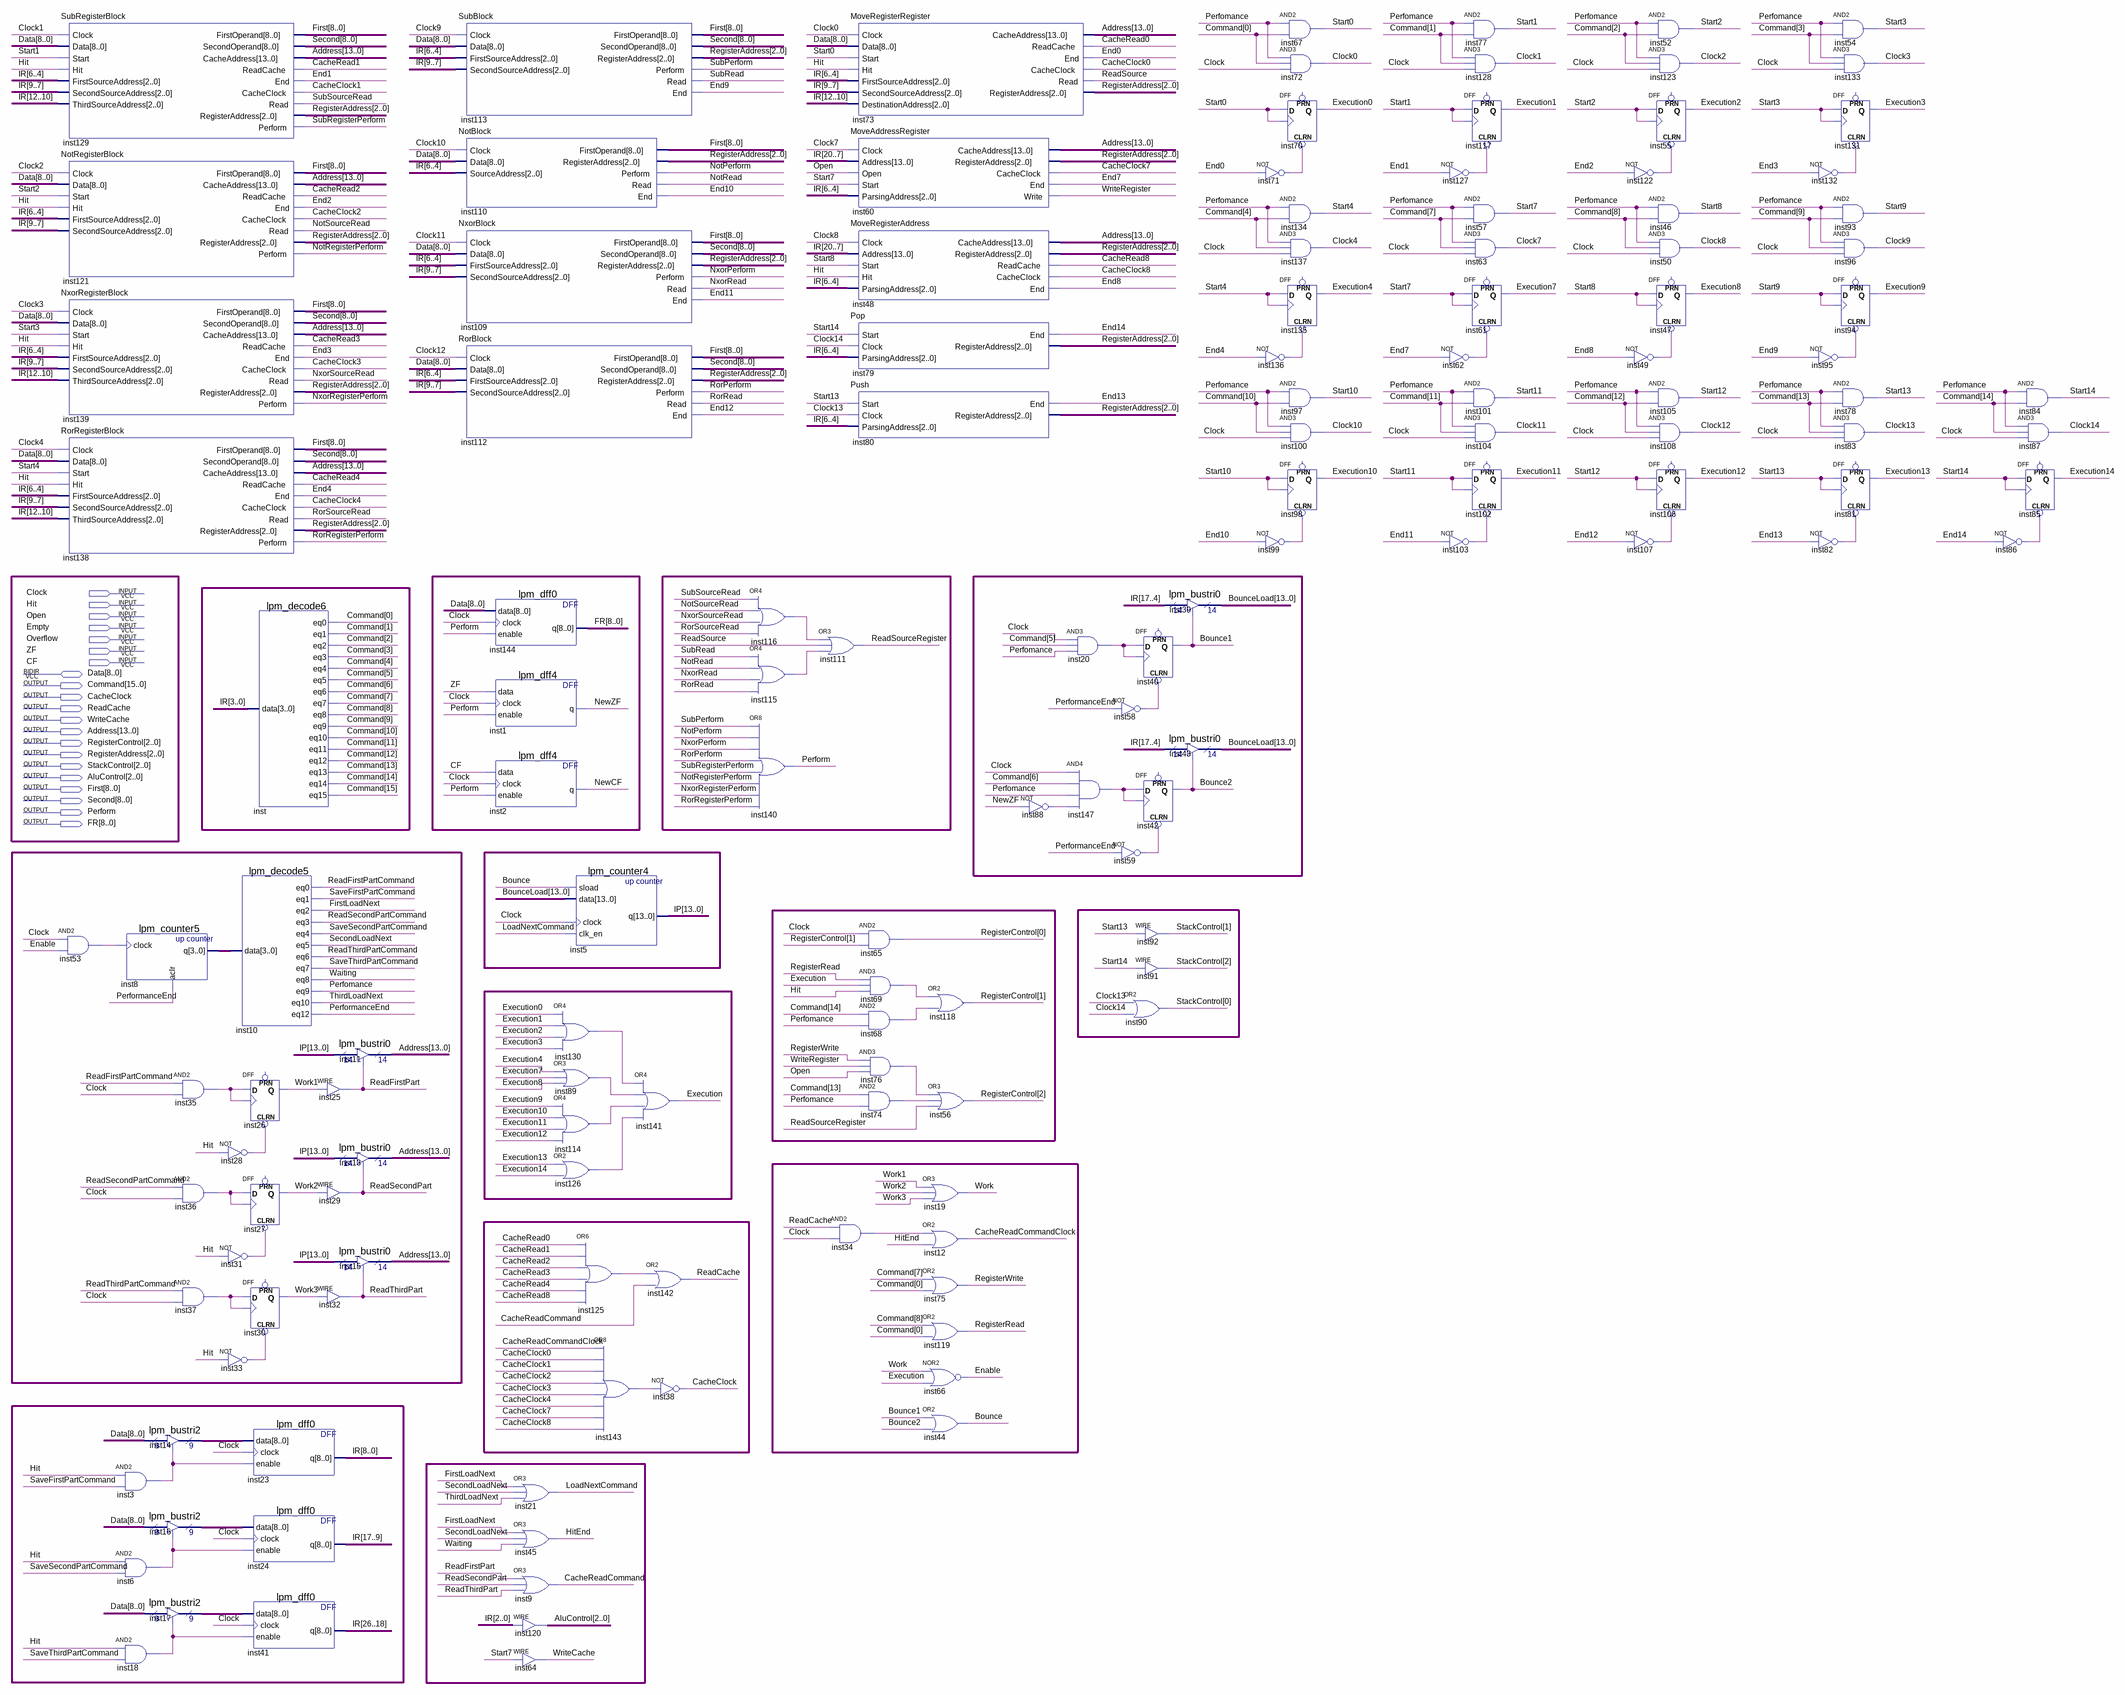
[diagram p0: schematic sheet]
// Quartus schematic ControlUnitBlock.bdf as structural Verilog: 141 symbols, 21 pins
module ControlUnitBlock (
  input  Clock,
  input  Hit,
  input  Open,
  input  Empty,
  input  Overflow,
  input  ZF,
  input  CF,
  inout  [8:0] Data,
  output [15:0] Command,
  output CacheClock,
  output ReadCache,
  output WriteCache,
  output [13:0] Address,
  output [2:0] RegisterControl,
  output [2:0] RegisterAddress,
  output [2:0] StackControl,
  output [2:0] AluControl,
  output [8:0] First,
  output [8:0] Second,
  output Perform,
  output [8:0] FR
);

  wire Bounce, Bounce1, Bounce2, CacheClock0, CacheClock1, CacheClock2, CacheClock3, CacheClock4,
       CacheClock7, CacheClock8, CacheRead0, CacheRead1, CacheRead2, CacheRead3, CacheRead4, CacheRead8,
       CacheReadCommand, CacheReadCommandClock, Clock0, Clock1, Clock2, Clock3, Clock4, Clock7, Clock8,
       Clock9, Clock10, Clock11, Clock12, Clock13, Clock14, Enable, End0, End1, End2, End3, End4, End7, End8,
       End9, End10, End11, End12, End13, End14, Execution, Execution0, Execution1, Execution2, Execution3,
       Execution4, Execution7, Execution8, Execution9, Execution10, Execution11, Execution12, Execution13,
       Execution14, FirstLoadNext, HitEnd, inst3_out, inst6_out, inst18_out, inst20_out, inst28_out,
       inst31_out, inst33_out, inst34_out, inst35_out, inst36_out, inst37_out, inst49_out, inst53_out,
       inst58_out, inst59_out, inst62_out, inst68_out, inst69_out, inst71_out, inst74_out, inst76_out,
       inst82_out, inst86_out, inst88_out, inst89_out, inst95_out, inst99_out, inst103_out, inst107_out,
       inst114_out, inst115_out, inst116_out, inst122_out, inst125_out, inst126_out, inst127_out,
       inst130_out, inst132_out, inst136_out, inst143_out, inst147_out, LoadNextCommand, NewCF, NewZF,
       NotPerform, NotRead, NotRegisterPerform, NotSourceRead, NxorPerform, NxorRead, NxorRegisterPerform,
       NxorSourceRead, Perfomance, PerformanceEnd, ReadFirstPart, ReadFirstPartCommand, ReadSecondPart,
       ReadSecondPartCommand, ReadSource, ReadSourceRegister, ReadThirdPart, ReadThirdPartCommand,
       RegisterRead, RegisterWrite, RorPerform, RorRead, RorRegisterPerform, RorSourceRead,
       SaveFirstPartCommand, SaveSecondPartCommand, SaveThirdPartCommand, SecondLoadNext, Start0, Start1,
       Start2, Start3, Start4, Start7, Start8, Start9, Start10, Start11, Start12, Start13, Start14,
       SubPerform, SubRead, SubRegisterPerform, SubSourceRead, ThirdLoadNext, Waiting, Work, Work1, Work2,
       Work3, WriteRegister;
  wire [3:0] inst8_q;
  wire [8:0] inst14_tridata, inst16_tridata, inst17_tridata;
  wire [13:0] BounceLoad, IP;
  wire [26:0] IR;

  SubRegisterBlock inst129 (
    .Clock(Clock1), .Data(Data), .Start(Start1), .Hit(Hit), .FirstSourceAddress(IR[6:4]),
    .SecondSourceAddress(IR[9:7]), .ThirdSourceAddress(IR[12:10]), .FirstOperand(First),
    .SecondOperand(Second), .CacheAddress(Address), .ReadCache(CacheRead1), .End(End1),
    .CacheClock(CacheClock1), .Read(SubSourceRead), .RegisterAddress(RegisterAddress),
    .Perform(SubRegisterPerform));
  NotRegisterBlock inst121 (
    .Clock(Clock2), .Data(Data), .Start(Start2), .Hit(Hit), .FirstSourceAddress(IR[6:4]),
    .SecondSourceAddress(IR[9:7]), .FirstOperand(First), .CacheAddress(Address), .ReadCache(CacheRead2),
    .End(End2), .CacheClock(CacheClock2), .Read(NotSourceRead), .RegisterAddress(RegisterAddress),
    .Perform(NotRegisterPerform));
  NxorRegisterBlock inst139 (
    .Clock(Clock3), .Data(Data), .Start(Start3), .Hit(Hit), .FirstSourceAddress(IR[6:4]),
    .SecondSourceAddress(IR[9:7]), .ThirdSourceAddress(IR[12:10]), .FirstOperand(First),
    .SecondOperand(Second), .CacheAddress(Address), .ReadCache(CacheRead3), .End(End3),
    .CacheClock(CacheClock3), .Read(NxorSourceRead), .RegisterAddress(RegisterAddress),
    .Perform(NxorRegisterPerform));
  RorRegisterBlock inst138 (
    .Clock(Clock4), .Data(Data), .Start(Start4), .Hit(Hit), .FirstSourceAddress(IR[6:4]),
    .SecondSourceAddress(IR[9:7]), .ThirdSourceAddress(IR[12:10]), .FirstOperand(First),
    .SecondOperand(Second), .CacheAddress(Address), .ReadCache(CacheRead4), .End(End4),
    .CacheClock(CacheClock4), .Read(RorSourceRead), .RegisterAddress(RegisterAddress),
    .Perform(RorRegisterPerform));
  and inst53 (inst53_out, Clock, Enable);
  lpm_counter5 inst8 (.clock(inst53_out), .aclr(PerformanceEnd), .q(inst8_q));
  lpm_bustri2 inst14 (.enabledt(inst3_out), .data(Data), .tridata(inst14_tridata));
  and inst3 (inst3_out, Hit, SaveFirstPartCommand);
  lpm_bustri2 inst16 (.enabledt(inst6_out), .data(Data), .tridata(inst16_tridata));
  and inst6 (inst6_out, Hit, SaveSecondPartCommand);
  lpm_bustri2 inst17 (.enabledt(inst18_out), .data(Data), .tridata(inst17_tridata));
  and inst18 (inst18_out, Hit, SaveThirdPartCommand);
  and inst35 (inst35_out, ReadFirstPartCommand, Clock);
  and inst36 (inst36_out, ReadSecondPartCommand, Clock);
  and inst37 (inst37_out, ReadThirdPartCommand, Clock);
  lpm_decode5 inst10 (
    .data(inst8_q), .eq0(ReadFirstPartCommand), .eq1(SaveFirstPartCommand), .eq2(FirstLoadNext),
    .eq3(ReadSecondPartCommand), .eq4(SaveSecondPartCommand), .eq5(SecondLoadNext),
    .eq6(ReadThirdPartCommand), .eq7(SaveThirdPartCommand), .eq8(Waiting), .eq9(Perfomance),
    .eq10(ThirdLoadNext), .eq12(PerformanceEnd));
  not inst28 (inst28_out, Hit);
  not inst31 (inst31_out, Hit);
  not inst33 (inst33_out, Hit);
  lpm_decode6 inst (
    .data(IR[3:0]), .eq0(Command[0]), .eq1(Command[1]), .eq2(Command[2]), .eq3(Command[3]), .eq4(Command[4]),
    .eq5(Command[5]), .eq6(Command[6]), .eq7(Command[7]), .eq8(Command[8]), .eq9(Command[9]),
    .eq10(Command[10]), .eq11(Command[11]), .eq12(Command[12]), .eq13(Command[13]), .eq14(Command[14]),
    .eq15(Command[15]));
  DFF inst26 (.CLRN(inst28_out), .CLK(inst35_out), .D(inst35_out), .Q(Work1));  // open: PRN
  DFF inst27 (.CLRN(inst31_out), .CLK(inst36_out), .D(inst36_out), .Q(Work2));  // open: PRN
  DFF inst30 (.CLRN(inst33_out), .CLK(inst37_out), .D(inst37_out), .Q(Work3));  // open: PRN
  lpm_dff0 inst23 (.data(inst14_tridata), .clock(Clock), .enable(inst3_out), .q(IR[8:0]));
  lpm_dff0 inst24 (.data(inst16_tridata), .clock(Clock), .enable(inst6_out), .q(IR[17:9]));
  lpm_dff0 inst41 (.data(inst17_tridata), .clock(Clock), .enable(inst18_out), .q(IR[26:18]));
  assign ReadFirstPart = Work1;  // WIRE inst25
  assign ReadSecondPart = Work2;  // WIRE inst29
  assign ReadThirdPart = Work3;  // WIRE inst32
  lpm_bustri0 inst11 (.enabledt(ReadFirstPart), .data(IP), .tridata(Address));
  lpm_bustri0 inst13 (.enabledt(ReadSecondPart), .data(IP), .tridata(Address));
  lpm_bustri0 inst15 (.enabledt(ReadThirdPart), .data(IP), .tridata(Address));
  SubBlock inst113 (
    .Clock(Clock9), .Data(Data), .FirstSourceAddress(IR[6:4]), .SecondSourceAddress(IR[9:7]),
    .FirstOperand(First), .SecondOperand(Second), .RegisterAddress(RegisterAddress), .Perform(SubPerform),
    .Read(SubRead), .End(End9));
  NotBlock inst110 (
    .Clock(Clock10), .Data(Data), .SourceAddress(IR[6:4]), .FirstOperand(First),
    .RegisterAddress(RegisterAddress), .Perform(NotPerform), .Read(NotRead), .End(End10));
  NxorBlock inst109 (
    .Clock(Clock11), .Data(Data), .FirstSourceAddress(IR[6:4]), .SecondSourceAddress(IR[9:7]),
    .FirstOperand(First), .SecondOperand(Second), .RegisterAddress(RegisterAddress), .Perform(NxorPerform),
    .Read(NxorRead), .End(End11));
  RorBlock inst112 (
    .Clock(Clock12), .Data(Data), .FirstSourceAddress(IR[6:4]), .SecondSourceAddress(IR[9:7]),
    .FirstOperand(First), .SecondOperand(Second), .RegisterAddress(RegisterAddress), .Perform(RorPerform),
    .Read(RorRead), .End(End12));
  lpm_dff0 inst144 (.data(Data), .clock(Clock), .enable(Perform), .q(FR));
  lpm_dff4 inst1 (.data(ZF), .clock(Clock), .enable(Perform), .q(NewZF));
  lpm_dff4 inst2 (.data(CF), .clock(Clock), .enable(Perform), .q(NewCF));
  or inst21 (LoadNextCommand, FirstLoadNext, SecondLoadNext, ThirdLoadNext);
  or inst45 (HitEnd, FirstLoadNext, SecondLoadNext, Waiting);
  or inst9 (CacheReadCommand, ReadFirstPart, ReadSecondPart, ReadThirdPart);
  assign AluControl = IR[2:0];  // WIRE inst120
  assign WriteCache = Start7;  // WIRE inst64
  or inst130 (inst130_out, Execution0, Execution1, Execution2, Execution3);
  or inst89 (inst89_out, Execution4, Execution7, Execution8);
  or inst114 (inst114_out, Execution9, Execution10, Execution11, Execution12);
  or inst126 (inst126_out, Execution13, Execution14);
  lpm_counter4 inst5 (.sload(Bounce), .data(BounceLoad), .clock(Clock), .clk_en(LoadNextCommand), .q(IP));
  or inst125 (inst125_out, CacheRead0, CacheRead1, CacheRead2, CacheRead3, CacheRead4, CacheRead8);
  or inst143 (inst143_out, CacheReadCommandClock, CacheClock0, CacheClock1, CacheClock2, CacheClock3, CacheClock4, CacheClock7, CacheClock8);
  or inst141 (Execution, inst130_out, inst89_out, inst114_out, inst126_out);
  or inst142 (ReadCache, inst125_out, CacheReadCommand);
  not inst38 (CacheClock, inst143_out);
  or inst116 (inst116_out, SubSourceRead, NotSourceRead, NxorSourceRead, RorSourceRead);
  or inst115 (inst115_out, SubRead, NotRead, NxorRead, RorRead);
  or inst140 (Perform, SubPerform, NotPerform, NxorPerform, RorPerform, SubRegisterPerform, NotRegisterPerform, NxorRegisterPerform, RorRegisterPerform);
  or inst111 (ReadSourceRegister, inst116_out, ReadSource, inst115_out);
  and inst34 (inst34_out, ReadCache, Clock);
  MoveRegisterRegister inst73 (
    .Clock(Clock0), .Data(Data), .Start(Start0), .Hit(Hit), .FirstSourceAddress(IR[6:4]),
    .SecondSourceAddress(IR[9:7]), .DestinationAddress(IR[12:10]), .CacheAddress(Address),
    .ReadCache(CacheRead0), .End(End0), .CacheClock(CacheClock0), .Read(ReadSource),
    .RegisterAddress(RegisterAddress));
  MoveAddressRegister inst60 (
    .Clock(Clock7), .Address(IR[20:7]), .Open(Open), .Start(Start7), .ParsingAddress(IR[6:4]),
    .CacheAddress(Address), .RegisterAddress(RegisterAddress), .CacheClock(CacheClock7), .End(End7),
    .Write(WriteRegister));
  MoveRegisterAddress inst48 (
    .Clock(Clock8), .Address(IR[20:7]), .Start(Start8), .Hit(Hit), .ParsingAddress(IR[6:4]),
    .CacheAddress(Address), .RegisterAddress(RegisterAddress), .ReadCache(CacheRead8),
    .CacheClock(CacheClock8), .End(End8));
  Pop inst79 (
    .Start(Start14), .Clock(Clock14), .ParsingAddress(IR[6:4]), .End(End14), .RegisterAddress(RegisterAddress));
  Push inst80 (
    .Start(Start13), .Clock(Clock13), .ParsingAddress(IR[6:4]), .End(End13), .RegisterAddress(RegisterAddress));
  and inst65 (RegisterControl[0], Clock, RegisterControl[1]);
  and inst69 (inst69_out, RegisterRead, Execution, Hit);
  and inst68 (inst68_out, Command[14], Perfomance);
  and inst76 (inst76_out, RegisterWrite, WriteRegister, Open);
  and inst74 (inst74_out, Command[13], Perfomance);
  or inst118 (RegisterControl[1], inst69_out, inst68_out);
  or inst56 (RegisterControl[2], inst76_out, inst74_out, ReadSourceRegister);
  or inst19 (Work, Work1, Work2, Work3);
  or inst12 (CacheReadCommandClock, inst34_out, HitEnd);
  or inst75 (RegisterWrite, Command[7], Command[0]);
  or inst119 (RegisterRead, Command[8], Command[0]);
  nor inst66 (Enable, Work, Execution);
  or inst44 (Bounce, Bounce1, Bounce2);
  not inst88 (inst88_out, NewZF);
  and inst20 (inst20_out, Clock, Command[5], Perfomance);
  and inst147 (inst147_out, Clock, Command[6], Perfomance, inst88_out);
  not inst58 (inst58_out, PerformanceEnd);
  not inst59 (inst59_out, PerformanceEnd);
  DFF inst40 (.CLRN(inst58_out), .CLK(inst20_out), .D(inst20_out), .Q(Bounce1));  // open: PRN
  DFF inst42 (.CLRN(inst59_out), .CLK(inst147_out), .D(inst147_out), .Q(Bounce2));  // open: PRN
  assign StackControl[1] = Start13;  // WIRE inst92
  assign StackControl[2] = Start14;  // WIRE inst91
  or inst90 (StackControl[0], Clock13, Clock14);
  lpm_bustri0 inst39 (.enabledt(Bounce1), .data(IR[17:4]), .tridata(BounceLoad));
  lpm_bustri0 inst43 (.enabledt(Bounce2), .data(IR[17:4]), .tridata(BounceLoad));
  and inst67 (Start0, Perfomance, Command[0]);
  and inst72 (Clock0, Perfomance, Command[0], Clock);
  DFF inst70 (.CLRN(inst71_out), .CLK(Start0), .D(Start0), .Q(Execution0));  // open: PRN
  not inst71 (inst71_out, End0);
  and inst134 (Start4, Perfomance, Command[4]);
  and inst137 (Clock4, Perfomance, Command[4], Clock);
  DFF inst135 (.CLRN(inst136_out), .CLK(Start4), .D(Start4), .Q(Execution4));  // open: PRN
  not inst136 (inst136_out, End4);
  and inst97 (Start10, Perfomance, Command[10]);
  and inst100 (Clock10, Perfomance, Command[10], Clock);
  DFF inst98 (.CLRN(inst99_out), .CLK(Start10), .D(Start10), .Q(Execution10));  // open: PRN
  not inst99 (inst99_out, End10);
  and inst77 (Start1, Perfomance, Command[1]);
  and inst128 (Clock1, Perfomance, Command[1], Clock);
  DFF inst117 (.CLRN(inst127_out), .CLK(Start1), .D(Start1), .Q(Execution1));  // open: PRN
  not inst127 (inst127_out, End1);
  and inst57 (Start7, Perfomance, Command[7]);
  and inst63 (Clock7, Perfomance, Command[7], Clock);
  DFF inst61 (.CLRN(inst62_out), .CLK(Start7), .D(Start7), .Q(Execution7));  // open: PRN
  not inst62 (inst62_out, End7);
  and inst101 (Start11, Perfomance, Command[11]);
  and inst104 (Clock11, Perfomance, Command[11], Clock);
  DFF inst102 (.CLRN(inst103_out), .CLK(Start11), .D(Start11), .Q(Execution11));  // open: PRN
  not inst103 (inst103_out, End11);
  and inst52 (Start2, Perfomance, Command[2]);
  and inst123 (Clock2, Perfomance, Command[2], Clock);
  DFF inst55 (.CLRN(inst122_out), .CLK(Start2), .D(Start2), .Q(Execution2));  // open: PRN
  not inst122 (inst122_out, End2);
  and inst46 (Start8, Perfomance, Command[8]);
  and inst50 (Clock8, Perfomance, Command[8], Clock);
  DFF inst47 (.CLRN(inst49_out), .CLK(Start8), .D(Start8), .Q(Execution8));  // open: PRN
  not inst49 (inst49_out, End8);
  and inst105 (Start12, Perfomance, Command[12]);
  and inst108 (Clock12, Perfomance, Command[12], Clock);
  DFF inst106 (.CLRN(inst107_out), .CLK(Start12), .D(Start12), .Q(Execution12));  // open: PRN
  not inst107 (inst107_out, End12);
  and inst54 (Start3, Perfomance, Command[3]);
  and inst133 (Clock3, Perfomance, Command[3], Clock);
  DFF inst131 (.CLRN(inst132_out), .CLK(Start3), .D(Start3), .Q(Execution3));  // open: PRN
  not inst132 (inst132_out, End3);
  and inst93 (Start9, Perfomance, Command[9]);
  and inst96 (Clock9, Perfomance, Command[9], Clock);
  DFF inst94 (.CLRN(inst95_out), .CLK(Start9), .D(Start9), .Q(Execution9));  // open: PRN
  not inst95 (inst95_out, End9);
  and inst78 (Start13, Perfomance, Command[13]);
  and inst83 (Clock13, Perfomance, Command[13], Clock);
  DFF inst81 (.CLRN(inst82_out), .CLK(Start13), .D(Start13), .Q(Execution13));  // open: PRN
  not inst82 (inst82_out, End13);
  and inst84 (Start14, Perfomance, Command[14]);
  and inst87 (Clock14, Perfomance, Command[14], Clock);
  DFF inst85 (.CLRN(inst86_out), .CLK(Start14), .D(Start14), .Q(Execution14));  // open: PRN
  not inst86 (inst86_out, End14);
endmodule
